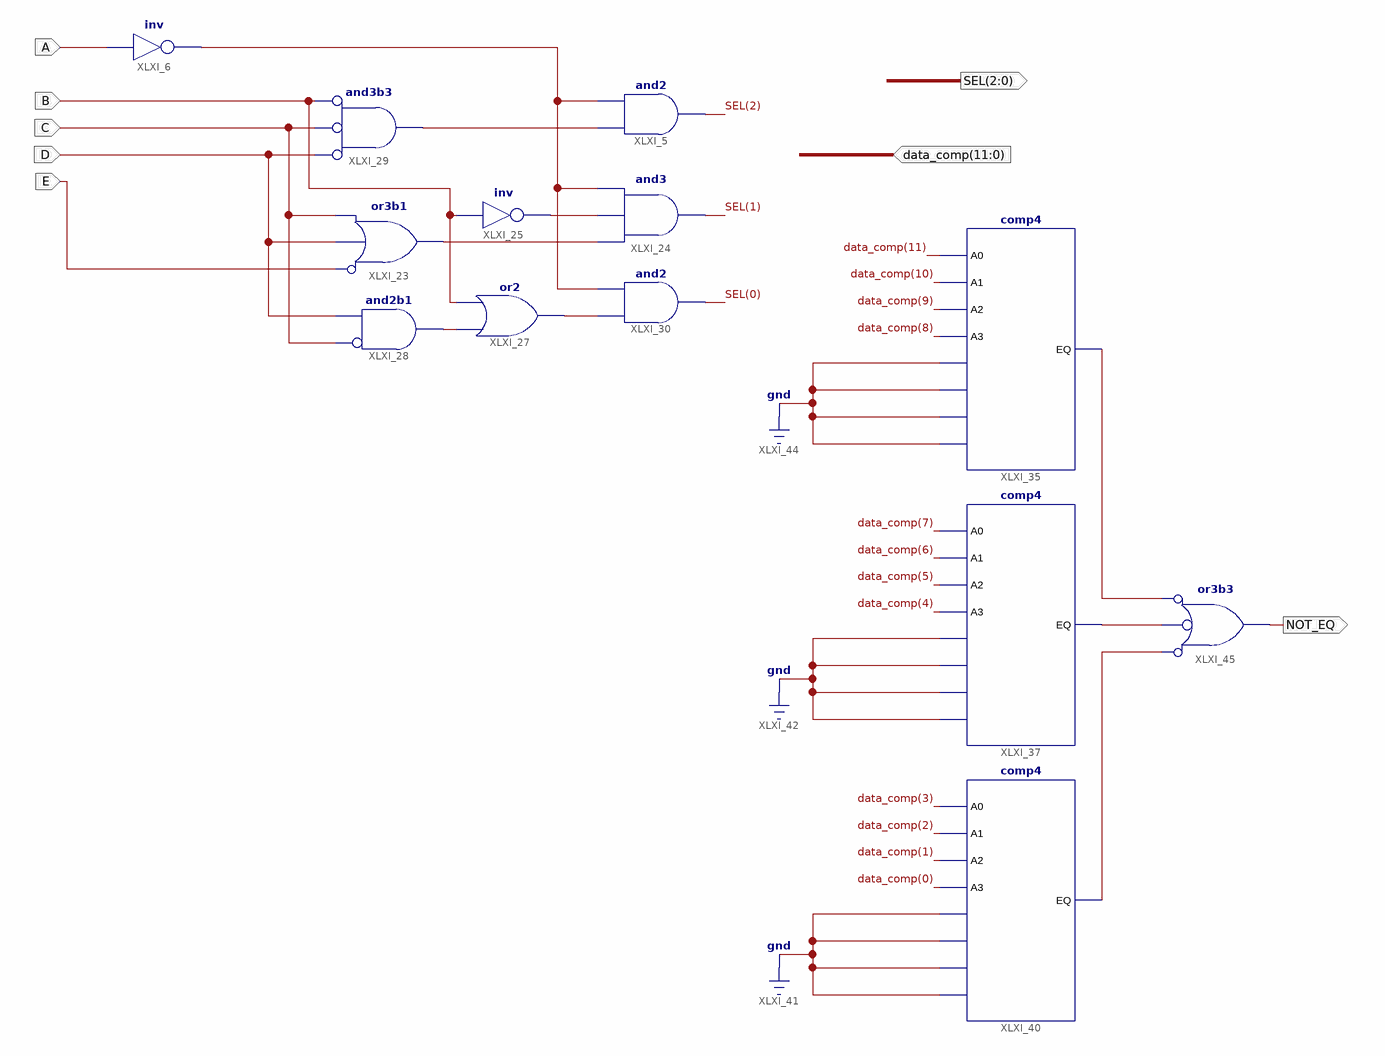
[diagram p0: schematic sheet 1]
// Xilinx ISE schematic encoder5to3_with_dataComp.sch (spartan6) as structural Verilog: 13 symbols, 8 ports
module encoder5to3_with_dataComp (
  input  A,
  input  E,
  input  D,
  input  C,
  input  B,
  input  [11:0] data_comp,
  output NOT_EQ,
  output [2:0] SEL
);

  wire XLXN_17, XLXN_18, XLXN_58, XLXN_62, XLXN_73, XLXN_83, XLXN_96, XLXN_97, XLXN_98;

  and XLXI_5 (SEL[2], XLXN_18, XLXN_17);
  not XLXI_6 (XLXN_17, A);
  and XLXI_24 (SEL[1], XLXN_58, XLXN_62, XLXN_17);
  not XLXI_25 (XLXN_62, B);
  or XLXI_27 (XLXN_83, XLXN_73, B);
  or XLXI_23 (XLXN_58, ~E, D, C);  // or3b1
  and XLXI_28 (XLXN_73, ~C, D);  // and2b1
  and XLXI_29 (XLXN_18, ~D, ~C, ~B);  // and3b3
  and XLXI_30 (SEL[0], XLXN_83, XLXN_17);
  comp4 XLXI_35 (
    .A0(data_comp[11]), .A1(data_comp[10]), .A2(data_comp[9]), .A3(data_comp[8]), .B0(1'b0), .B1(1'b0),
    .B2(1'b0), .B3(1'b0), .EQ(XLXN_97));
  comp4 XLXI_37 (
    .A0(data_comp[7]), .A1(data_comp[6]), .A2(data_comp[5]), .A3(data_comp[4]), .B0(1'b0), .B1(1'b0),
    .B2(1'b0), .B3(1'b0), .EQ(XLXN_98));
  comp4 XLXI_40 (
    .A0(data_comp[3]), .A1(data_comp[2]), .A2(data_comp[1]), .A3(data_comp[0]), .B0(1'b0), .B1(1'b0),
    .B2(1'b0), .B3(1'b0), .EQ(XLXN_96));
  or XLXI_45 (NOT_EQ, ~XLXN_96, ~XLXN_98, ~XLXN_97);  // or3b3
endmodule
